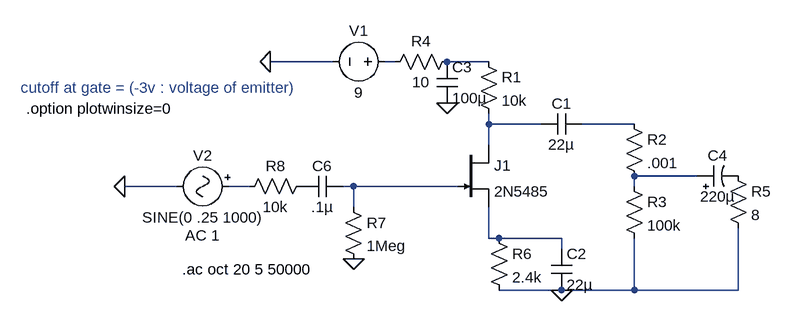
[diagram p0: schematic Fetzer.asc]
Fetzer.asc, the LTspice schematic file:
Version 4
SHEET 1 1064 1668
WIRE -96 48 -192 48
WIRE 0 48 -16 48
WIRE 144 48 80 48
WIRE 144 144 144 128
WIRE 224 144 144 144
WIRE 368 144 288 144
WIRE 144 176 144 144
WIRE 464 224 368 224
WIRE -336 240 -416 240
WIRE -224 240 -256 240
WIRE -64 240 -80 240
WIRE 96 240 -64 240
WIRE 368 240 368 224
WIRE -64 272 -64 240
WIRE 144 320 144 272
WIRE 160 320 144 320
WIRE 256 320 160 320
WIRE 256 336 256 320
WIRE 256 400 160 400
WIRE 368 400 368 320
WIRE 368 400 256 400
WIRE 528 400 528 304
WIRE 528 400 368 400
FLAG -192 48 0
FLAG -416 240 0
FLAG 256 400 0
FLAG -64 352 0
FLAG 80 112 0
SYMBOL njf 96 176 R0
SYMATTR InstName J1
SYMATTR Value 2N5485
SYMBOL voltage 0 48 R90
WINDOW 0 -32 56 VBottom 0
WINDOW 3 32 56 VTop 0
WINDOW 123 0 0 Left 0
WINDOW 39 0 0 Left 0
SYMATTR InstName V1
SYMATTR Value 9
SYMBOL res 128 32 R0
SYMATTR InstName R1
SYMATTR Value 10k
SYMBOL cap 288 128 R90
WINDOW 0 0 32 VBottom 0
WINDOW 3 32 32 VTop 0
SYMATTR InstName C1
SYMATTR Value 22µ
SYMBOL res 352 128 R0
SYMATTR InstName R2
SYMATTR Value .001
SYMBOL res 352 224 R0
SYMATTR InstName R3
SYMATTR Value 100k
SYMBOL Misc\\signal -240 240 R90
WINDOW 0 -32 56 VBottom 0
WINDOW 3 32 56 VTop 0
WINDOW 123 60 56 VTop 0
WINDOW 39 0 0 Left 0
SYMATTR InstName V2
SYMATTR Value SINE(0 .25 1000)
SYMATTR Value2 AC 1
SYMBOL res 144 304 R0
SYMATTR InstName R6
SYMATTR Value 2.4k
SYMBOL cap 240 336 R0
SYMATTR InstName C2
SYMATTR Value 22µ
SYMBOL res -80 256 R0
SYMATTR InstName R7
SYMATTR Value 1Meg
SYMBOL polcap 464 240 R270
WINDOW 0 32 32 VTop 0
WINDOW 3 0 32 VBottom 0
SYMATTR InstName C4
SYMATTR Value 220µ
SYMBOL cap -80 224 R90
WINDOW 0 0 32 VBottom 0
WINDOW 3 32 32 VTop 0
SYMATTR InstName C6
SYMATTR Value .1µ
SYMBOL res 96 32 R90
WINDOW 0 0 56 VBottom 0
WINDOW 3 32 56 VTop 0
SYMATTR InstName R4
SYMATTR Value 10
SYMBOL cap 64 48 R0
SYMATTR InstName C3
SYMATTR Value 100µ
SYMBOL res 512 208 R0
SYMATTR InstName R5
SYMATTR Value 8
SYMBOL res -128 224 R90
WINDOW 0 0 56 VBottom 0
WINDOW 3 32 56 VTop 0
SYMATTR InstName R8
SYMATTR Value 10k
TEXT -328 368 Left 0 !.ac oct 20 5 50000
TEXT -576 88 Left 0 ;cutoff at gate = (-3v : voltage of emitter)
TEXT -568 120 Left 0 !.option plotwinsize=0

The netlist it stands for:
* Fetzer.asc
J1 N003 N007 N008 2N5485
V1 N001 0 9
R1 N002 N003 10k
C1 N004 N003 22µ
R2 N004 N005 .001
R3 N005 0 100k
V2 N006 0 SINE(0 .25 1000) AC 1
R6 N008 0 2.4k
C2 N008 0 22µ
R7 N007 0 1Meg
C4 N005 P001 220µ
C6 N007 P002 .1µ
R4 N002 N001 10
C3 N002 0 100µ
R5 P001 0 8
R8 P002 N006 10k
.model NJF NJF
.model PJF PJF
.lib standard.jft
.ac oct 20 5 50000
* cutoff at gate = (-3v : voltage of emitter)
.option plotwinsize=0
.backanno
.end